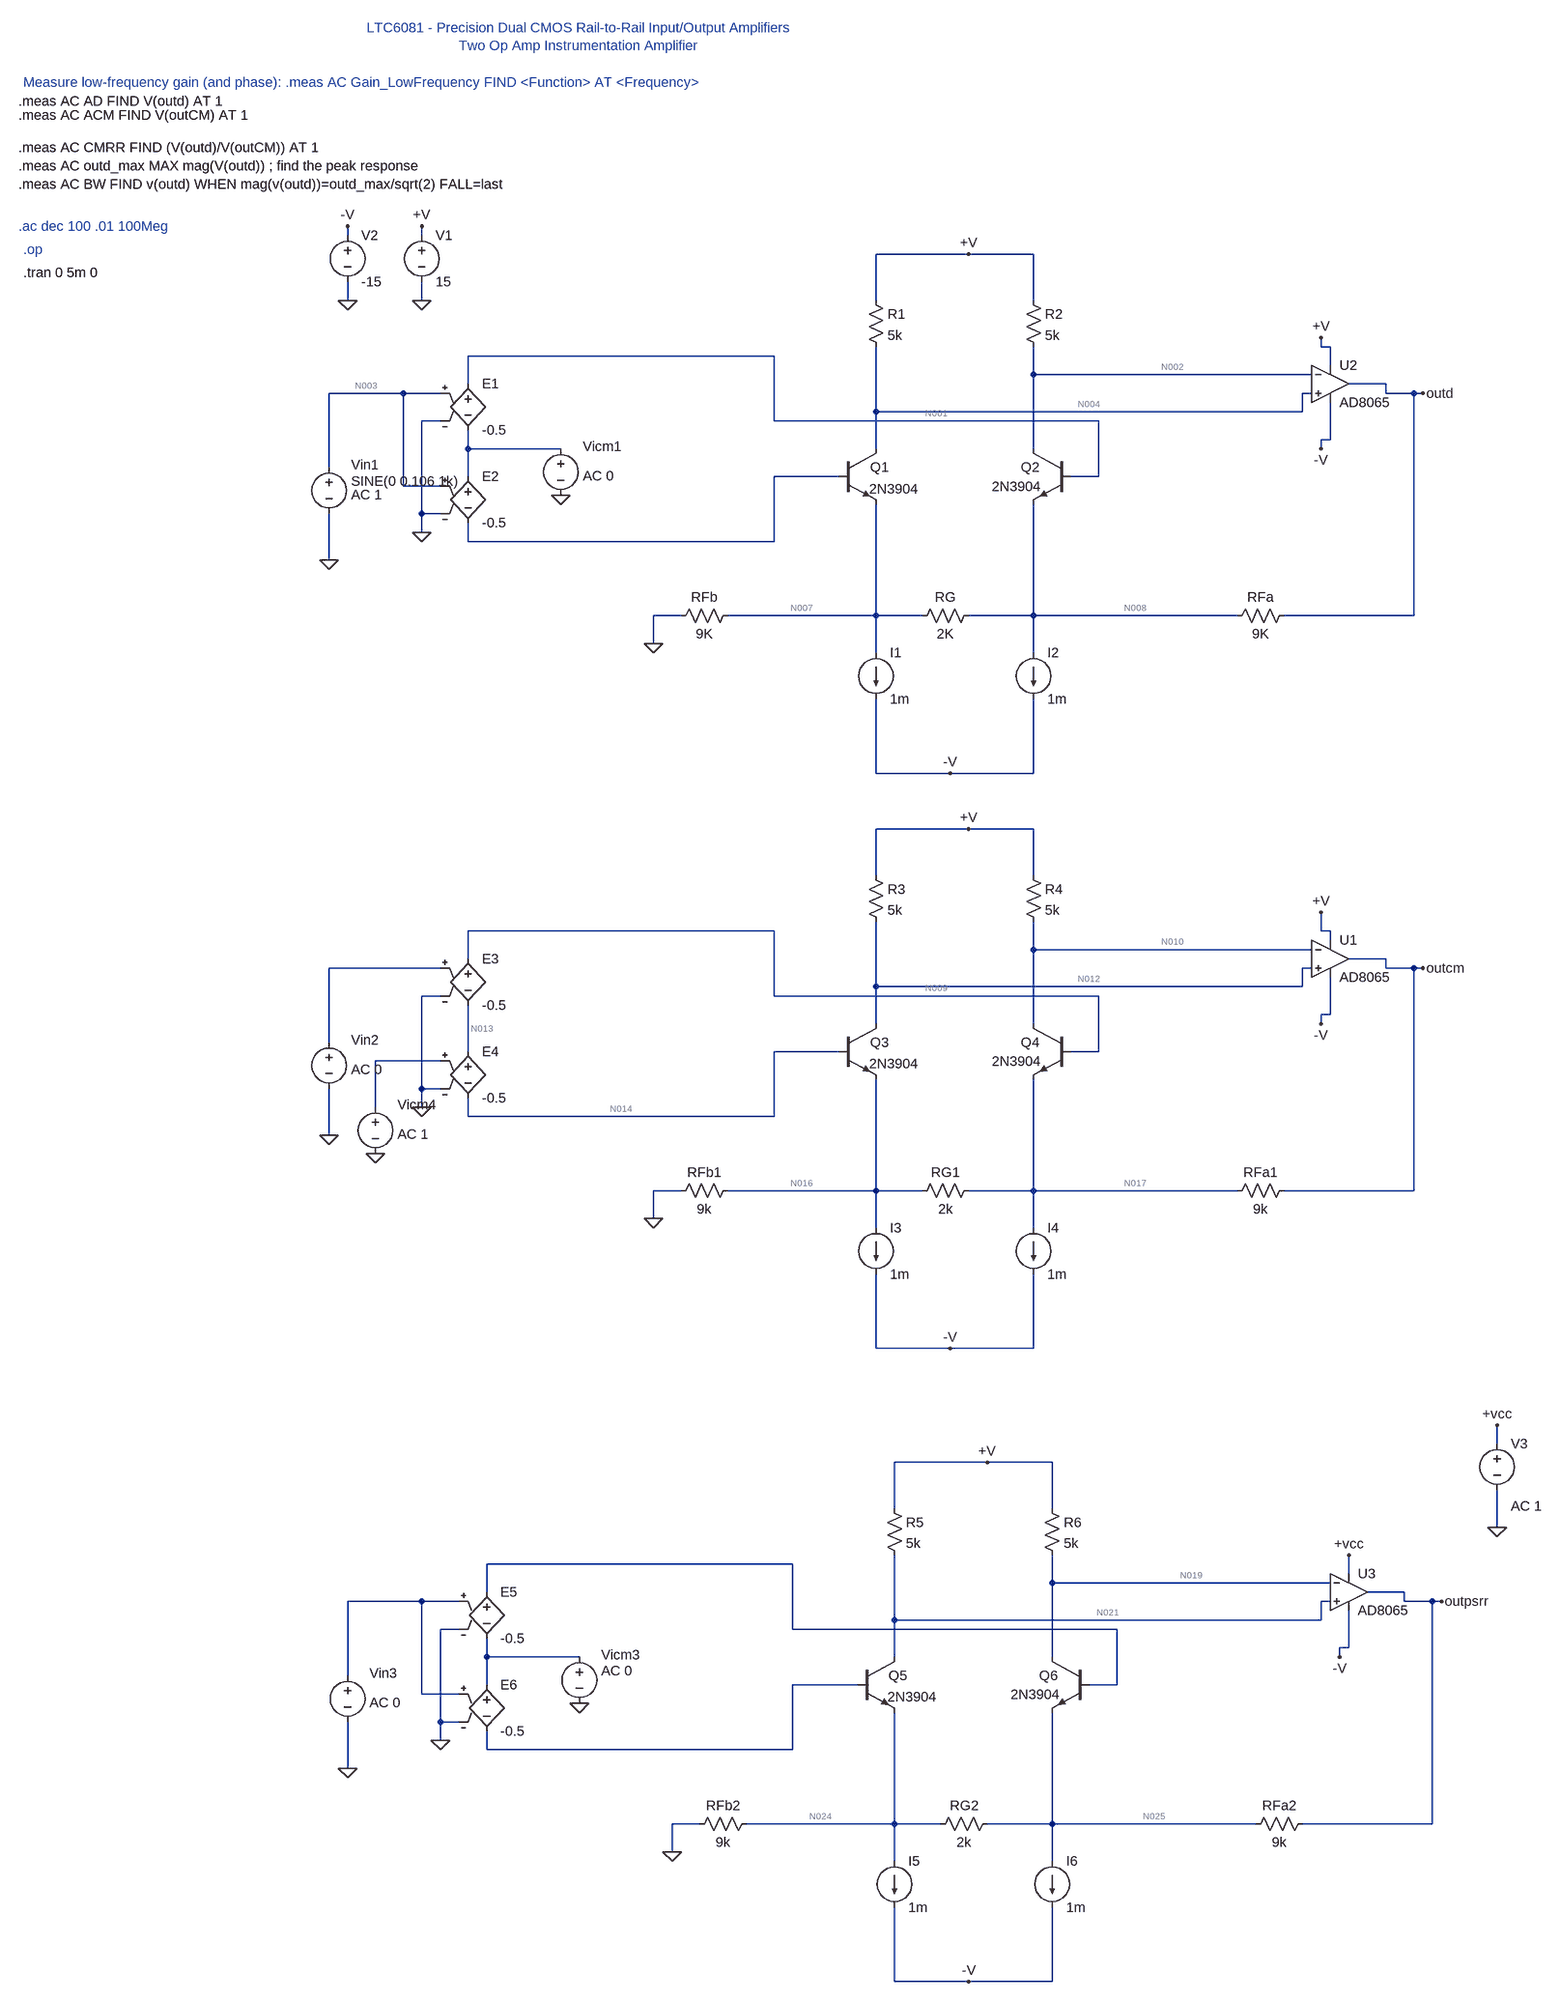
[diagram p0: schematic etaj1.asc]
etaj1.asc, the LTspice schematic file:
Version 4
SHEET 1 3464 3132
WIRE -800 -128 -800 -144
WIRE -672 -128 -672 -144
WIRE 272 -96 112 -96
WIRE 384 -96 272 -96
WIRE -800 -16 -800 -48
WIRE -672 -16 -672 -48
WIRE 112 -16 112 -96
WIRE 384 -16 384 -96
WIRE 880 64 880 48
WIRE 896 64 880 64
WIRE -64 80 -592 80
WIRE 896 96 896 64
WIRE 384 112 384 64
WIRE 864 112 384 112
WIRE -592 128 -592 80
WIRE 992 128 928 128
WIRE -704 144 -832 144
WIRE -640 144 -704 144
WIRE 864 144 848 144
WIRE 992 144 992 128
WIRE 1040 144 992 144
WIRE 1056 144 1040 144
WIRE 112 176 112 64
WIRE 848 176 848 144
WIRE 848 176 112 176
WIRE -640 192 -672 192
WIRE -64 192 -64 80
WIRE 496 192 -64 192
WIRE 896 224 896 160
WIRE 896 224 880 224
WIRE -592 240 -592 208
WIRE -432 240 -592 240
WIRE 112 240 112 176
WIRE 384 240 384 112
WIRE 880 240 880 224
WIRE -832 272 -832 144
WIRE -592 288 -592 240
WIRE 48 288 -64 288
WIRE 496 288 496 192
WIRE 496 288 448 288
WIRE -704 304 -704 144
WIRE -640 304 -704 304
WIRE -672 352 -672 192
WIRE -640 352 -672 352
WIRE -672 384 -672 352
WIRE -592 400 -592 368
WIRE -64 400 -64 288
WIRE -64 400 -592 400
WIRE -832 432 -832 352
WIRE -224 528 -272 528
WIRE 112 528 112 336
WIRE 112 528 -144 528
WIRE 192 528 112 528
WIRE 384 528 384 336
WIRE 384 528 272 528
WIRE 736 528 384 528
WIRE 1040 528 1040 144
WIRE 1040 528 816 528
WIRE -272 576 -272 528
WIRE 112 592 112 528
WIRE 384 592 384 528
WIRE 112 800 112 672
WIRE 240 800 112 800
WIRE 384 800 384 672
WIRE 384 800 240 800
WIRE 272 896 112 896
WIRE 384 896 272 896
WIRE 112 976 112 896
WIRE 384 976 384 896
WIRE -64 1072 -592 1072
WIRE 880 1072 880 1040
WIRE 896 1072 880 1072
WIRE 896 1088 896 1072
WIRE 384 1104 384 1056
WIRE 864 1104 384 1104
WIRE -592 1120 -592 1072
WIRE 992 1120 928 1120
WIRE -640 1136 -832 1136
WIRE 864 1136 848 1136
WIRE 992 1136 992 1120
WIRE 1040 1136 992 1136
WIRE 1056 1136 1040 1136
WIRE 112 1168 112 1056
WIRE 848 1168 848 1136
WIRE 848 1168 112 1168
WIRE -640 1184 -672 1184
WIRE -64 1184 -64 1072
WIRE 496 1184 -64 1184
WIRE 896 1216 896 1152
WIRE 896 1216 880 1216
WIRE 112 1232 112 1168
WIRE 384 1232 384 1104
WIRE 880 1232 880 1216
WIRE -832 1264 -832 1136
WIRE -592 1280 -592 1200
WIRE 48 1280 -64 1280
WIRE 496 1280 496 1184
WIRE 496 1280 448 1280
WIRE -640 1296 -752 1296
WIRE -672 1344 -672 1184
WIRE -640 1344 -672 1344
WIRE -752 1376 -752 1296
WIRE -672 1376 -672 1344
WIRE -592 1392 -592 1360
WIRE -64 1392 -64 1280
WIRE -64 1392 -592 1392
WIRE -832 1424 -832 1344
WIRE -224 1520 -272 1520
WIRE 112 1520 112 1328
WIRE 112 1520 -144 1520
WIRE 192 1520 112 1520
WIRE 384 1520 384 1328
WIRE 384 1520 272 1520
WIRE 736 1520 384 1520
WIRE 1040 1520 1040 1136
WIRE 1040 1520 816 1520
WIRE -272 1568 -272 1520
WIRE 112 1584 112 1520
WIRE 384 1584 384 1520
WIRE 112 1792 112 1664
WIRE 240 1792 112 1792
WIRE 384 1792 384 1664
WIRE 384 1792 240 1792
WIRE 1184 2160 1184 2128
WIRE 304 2192 144 2192
WIRE 416 2192 304 2192
WIRE 144 2272 144 2192
WIRE 416 2272 416 2192
WIRE 1184 2304 1184 2240
WIRE -32 2368 -560 2368
WIRE 928 2384 928 2352
WIRE 416 2400 416 2352
WIRE 896 2400 416 2400
WIRE -560 2416 -560 2368
WIRE 1024 2416 960 2416
WIRE -672 2432 -800 2432
WIRE -608 2432 -672 2432
WIRE 896 2432 880 2432
WIRE 1024 2432 1024 2416
WIRE 1072 2432 1024 2432
WIRE 1088 2432 1072 2432
WIRE 144 2464 144 2352
WIRE 880 2464 880 2432
WIRE 880 2464 144 2464
WIRE -608 2480 -640 2480
WIRE -32 2480 -32 2368
WIRE 528 2480 -32 2480
WIRE 928 2512 928 2448
WIRE 928 2512 912 2512
WIRE -560 2528 -560 2496
WIRE -400 2528 -560 2528
WIRE 144 2528 144 2464
WIRE 416 2528 416 2400
WIRE 912 2528 912 2512
WIRE -800 2560 -800 2432
WIRE -560 2576 -560 2528
WIRE 80 2576 -32 2576
WIRE 528 2576 528 2480
WIRE 528 2576 480 2576
WIRE -672 2592 -672 2432
WIRE -608 2592 -672 2592
WIRE -640 2640 -640 2480
WIRE -608 2640 -640 2640
WIRE -640 2672 -640 2640
WIRE -560 2688 -560 2656
WIRE -32 2688 -32 2576
WIRE -32 2688 -560 2688
WIRE -800 2720 -800 2640
WIRE -192 2816 -240 2816
WIRE 144 2816 144 2624
WIRE 144 2816 -112 2816
WIRE 224 2816 144 2816
WIRE 416 2816 416 2624
WIRE 416 2816 304 2816
WIRE 768 2816 416 2816
WIRE 1072 2816 1072 2432
WIRE 1072 2816 848 2816
WIRE -240 2864 -240 2816
WIRE 144 2880 144 2816
WIRE 416 2880 416 2816
WIRE 144 3088 144 2960
WIRE 272 3088 144 3088
WIRE 416 3088 416 2960
WIRE 416 3088 272 3088
FLAG -672 -16 0
FLAG -672 -144 +V
FLAG -800 -16 0
FLAG -800 -144 -V
FLAG 880 48 +V
FLAG 880 240 -V
FLAG 1056 144 outd
FLAG 272 -96 +V
FLAG -272 576 0
FLAG 240 800 -V
FLAG 880 1040 +V
FLAG 880 1232 -V
FLAG 1056 1136 outcm
FLAG 272 896 +V
FLAG -272 1568 0
FLAG 240 1792 -V
FLAG -832 432 0
FLAG -672 384 0
FLAG -432 320 0
FLAG -832 1424 0
FLAG -672 1376 0
FLAG -752 1456 0
FLAG 912 2528 -V
FLAG 1088 2432 outpsrr
FLAG 304 2192 +V
FLAG -240 2864 0
FLAG 272 3088 -V
FLAG -800 2720 0
FLAG -640 2672 0
FLAG -400 2608 0
FLAG 928 2352 +vcc
FLAG 1184 2304 0
FLAG 1184 2128 +vcc
DATAFLAG 112 112 ""
DATAFLAG 384 96 ""
DATAFLAG 112 480 ""
DATAFLAG 384 448 ""
DATAFLAG 1040 256 ""
DATAFLAG 112 1104 ""
DATAFLAG 384 1088 ""
DATAFLAG 112 1472 ""
DATAFLAG 384 1440 ""
DATAFLAG 1040 1248 ""
DATAFLAG 144 2400 ""
DATAFLAG 416 2384 ""
DATAFLAG 144 2768 ""
DATAFLAG 416 2736 ""
DATAFLAG 1072 2544 ""
SYMBOL voltage -672 -144 R0
WINDOW 123 0 0 Left 2
WINDOW 39 0 0 Left 2
SYMATTR InstName V1
SYMATTR Value 15
SYMBOL voltage -800 -144 R0
WINDOW 123 0 0 Left 2
WINDOW 39 0 0 Left 2
SYMATTR InstName V2
SYMATTR Value -15
SYMBOL npn 48 240 R0
WINDOW 0 54 32 Left 2
WINDOW 3 52 69 Left 2
SYMATTR InstName Q1
SYMATTR Value 2N3904
SYMBOL npn 448 240 M0
WINDOW 0 54 32 Left 2
WINDOW 3 51 65 Left 2
SYMATTR InstName Q2
SYMATTR Value 2N3904
SYMBOL res 96 -32 R0
SYMATTR InstName R1
SYMATTR Value 5k
SYMBOL res 368 -32 R0
SYMATTR InstName R2
SYMATTR Value 5k
SYMBOL res 832 512 R90
WINDOW 0 0 56 VBottom 2
WINDOW 3 32 56 VTop 2
SYMATTR InstName RFa
SYMATTR Value 9K
SYMBOL res 288 512 R90
WINDOW 0 0 56 VBottom 2
WINDOW 3 32 56 VTop 2
SYMATTR InstName RG
SYMATTR Value 2K
SYMBOL res -128 512 R90
WINDOW 0 0 56 VBottom 2
WINDOW 3 32 56 VTop 2
SYMATTR InstName RFb
SYMATTR Value 9K
SYMBOL current 112 592 R0
WINDOW 123 0 0 Left 0
WINDOW 39 0 0 Left 0
SYMATTR InstName I1
SYMATTR Value 1m
SYMBOL current 384 592 R0
WINDOW 123 0 0 Left 0
WINDOW 39 0 0 Left 0
SYMATTR InstName I2
SYMATTR Value 1m
SYMBOL npn 48 1232 R0
WINDOW 0 54 32 Left 2
WINDOW 3 52 69 Left 2
SYMATTR InstName Q3
SYMATTR Value 2N3904
SYMBOL npn 448 1232 M0
WINDOW 0 54 32 Left 2
WINDOW 3 51 65 Left 2
SYMATTR InstName Q4
SYMATTR Value 2N3904
SYMBOL res 96 960 R0
SYMATTR InstName R3
SYMATTR Value 5k
SYMBOL res 368 960 R0
SYMATTR InstName R4
SYMATTR Value 5k
SYMBOL res 832 1504 R90
WINDOW 0 0 56 VBottom 2
WINDOW 3 32 56 VTop 2
SYMATTR InstName RFa1
SYMATTR Value 9k
SYMBOL res 288 1504 R90
WINDOW 0 0 56 VBottom 2
WINDOW 3 32 56 VTop 2
SYMATTR InstName RG1
SYMATTR Value 2k
SYMBOL res -128 1504 R90
WINDOW 0 0 56 VBottom 2
WINDOW 3 32 56 VTop 2
SYMATTR InstName RFb1
SYMATTR Value 9k
SYMBOL current 112 1584 R0
WINDOW 123 0 0 Left 0
WINDOW 39 0 0 Left 0
SYMATTR InstName I3
SYMATTR Value 1m
SYMBOL current 384 1584 R0
WINDOW 123 0 0 Left 0
WINDOW 39 0 0 Left 0
SYMATTR InstName I4
SYMATTR Value 1m
SYMBOL voltage -832 256 R0
WINDOW 123 38 63 Left 2
WINDOW 39 0 0 Left 2
WINDOW 0 38 12 Left 2
WINDOW 3 38 40 Left 2
SYMATTR Value2 AC 1
SYMATTR InstName Vin1
SYMATTR Value SINE(0 0.106 1k)
SYMBOL e -592 112 R0
SYMATTR InstName E1
SYMATTR Value -0.5
SYMBOL e -592 272 R0
SYMATTR InstName E2
SYMATTR Value -0.5
SYMBOL voltage -432 224 R0
WINDOW 123 38 63 Left 2
WINDOW 39 0 0 Left 2
WINDOW 0 38 12 Left 2
WINDOW 3 -188 38 Left 2
SYMATTR Value2 AC 0
SYMATTR InstName Vicm1
SYMATTR Value ""
SYMBOL voltage -832 1248 R0
WINDOW 123 38 63 Left 2
WINDOW 39 0 0 Left 2
WINDOW 0 38 12 Left 2
WINDOW 3 -188 38 Left 2
SYMATTR Value2 AC 0
SYMATTR InstName Vin2
SYMATTR Value ""
SYMBOL e -592 1104 R0
SYMATTR InstName E3
SYMATTR Value -0.5
SYMBOL e -592 1264 R0
SYMATTR InstName E4
SYMATTR Value -0.5
SYMBOL OpAmps\\AD8065 896 64 R0
SYMATTR InstName U2
SYMBOL OpAmps\\AD8065 896 1056 R0
SYMATTR InstName U1
SYMBOL voltage -752 1360 R0
WINDOW 123 38 63 Left 2
WINDOW 39 0 0 Left 2
WINDOW 0 38 12 Left 2
WINDOW 3 -188 38 Left 2
SYMATTR Value2 AC 1
SYMATTR InstName Vicm4
SYMATTR Value ""
SYMBOL npn 80 2528 R0
WINDOW 0 54 32 Left 2
WINDOW 3 52 69 Left 2
SYMATTR InstName Q5
SYMATTR Value 2N3904
SYMBOL npn 480 2528 M0
WINDOW 0 54 32 Left 2
WINDOW 3 51 65 Left 2
SYMATTR InstName Q6
SYMATTR Value 2N3904
SYMBOL res 128 2256 R0
SYMATTR InstName R5
SYMATTR Value 5k
SYMBOL res 400 2256 R0
SYMATTR InstName R6
SYMATTR Value 5k
SYMBOL res 864 2800 R90
WINDOW 0 0 56 VBottom 2
WINDOW 3 32 56 VTop 2
SYMATTR InstName RFa2
SYMATTR Value 9k
SYMBOL res 320 2800 R90
WINDOW 0 0 56 VBottom 2
WINDOW 3 32 56 VTop 2
SYMATTR InstName RG2
SYMATTR Value 2k
SYMBOL res -96 2800 R90
WINDOW 0 0 56 VBottom 2
WINDOW 3 32 56 VTop 2
SYMATTR InstName RFb2
SYMATTR Value 9k
SYMBOL current 144 2880 R0
WINDOW 123 0 0 Left 0
WINDOW 39 0 0 Left 0
SYMATTR InstName I5
SYMATTR Value 1m
SYMBOL current 416 2880 R0
WINDOW 123 0 0 Left 0
WINDOW 39 0 0 Left 0
SYMATTR InstName I6
SYMATTR Value 1m
SYMBOL voltage -800 2544 R0
WINDOW 123 38 63 Left 2
WINDOW 39 0 0 Left 2
WINDOW 0 38 12 Left 2
WINDOW 3 -188 38 Left 2
SYMATTR Value2 AC 0
SYMATTR InstName Vin3
SYMATTR Value ""
SYMBOL e -560 2400 R0
SYMATTR InstName E5
SYMATTR Value -0.5
SYMBOL e -560 2560 R0
SYMATTR InstName E6
SYMATTR Value -0.5
SYMBOL voltage -400 2512 R0
WINDOW 123 38 40 Left 2
WINDOW 39 0 0 Left 2
WINDOW 0 38 12 Left 2
WINDOW 3 -188 38 Left 2
SYMATTR Value2 AC 0
SYMATTR InstName Vicm3
SYMATTR Value ""
SYMBOL OpAmps\\AD8065 928 2352 R0
SYMATTR InstName U3
SYMBOL voltage 1184 2144 R0
WINDOW 123 24 124 Left 2
WINDOW 39 0 0 Left 0
SYMATTR Value2 AC 1
SYMATTR InstName V3
SYMATTR Value ""
TEXT -1368 -144 Left 2 ;.ac dec 100 .01 100Meg
TEXT -1368 -360 Left 2 !.meas AC AD FIND V(outd) AT 1
TEXT -1360 -392 Left 2 ;Measure low-frequency gain (and phase): .meas AC Gain_LowFrequency FIND <Function> AT <Frequency>
TEXT -1368 -336 Left 2 !.meas AC ACM FIND V(outCM) AT 1
TEXT -1368 -280 Left 2 !.meas AC CMRR FIND (V(outd)/V(outCM)) AT 1
TEXT -400 -440 Bottom 2 ;LTC6081 - Precision Dual CMOS Rail-to-Rail Input/Output Amplifiers\nTwo Op Amp Instrumentation Amplifier
TEXT -1368 -248 Left 2 !.meas AC outd_max MAX mag(V(outd)) ; find the peak response\n.meas AC BW FIND v(outd) WHEN mag(v(outd))=outd_max/sqrt(2) FALL=last
TEXT -1360 -104 Left 2 ;.op
TEXT -1360 -64 Left 2 !.tran 0 5m 0

The netlist it stands for:
* etaj1.asc
V1 +V 0 15
V2 -V 0 -15
Q1 N004 N006 N007 0 2N3904
Q2 N002 N001 N008 0 2N3904
R1 +V N004 5k
R2 +V N002 5k
RFa outd N008 9K
RG N008 N007 2K
RFb N007 0 9K
I1 N007 -V 1m
I2 N008 -V 1m
Q3 N012 N014 N016 0 2N3904
Q4 N010 N009 N017 0 2N3904
R3 +V N012 5k
R4 +V N010 5k
RFa1 outcm N017 9k
RG1 N017 N016 2k
RFb1 N016 0 9k
I3 N016 -V 1m
I4 N017 -V 1m
Vin1 N003 0 SINE(0 0.106 1k) AC 1
E1 N001 N005 N003 0 -0.5
E2 N005 N006 N003 0 -0.5
Vicm1 N005 0 AC 0
Vin2 N011 0 AC 0
E3 N009 N013 N011 0 -0.5
E4 N013 N014 N015 0 -0.5
XU2 N004 N002 +V -V outd AD8065  ; pins In+ In- V+ V- OUT
XU1 N012 N010 +V -V outcm AD8065  ; pins In+ In- V+ V- OUT
Vicm4 N015 0 AC 1
Q5 N021 N023 N024 0 2N3904
Q6 N019 N018 N025 0 2N3904
R5 +V N021 5k
R6 +V N019 5k
RFa2 outpsrr N025 9k
RG2 N025 N024 2k
RFb2 N024 0 9k
I5 N024 -V 1m
I6 N025 -V 1m
Vin3 N020 0 AC 0
E5 N018 N022 N020 0 -0.5
E6 N022 N023 N020 0 -0.5
Vicm3 N022 0 AC 0
XU3 N021 N019 +vcc -V outpsrr AD8065  ; pins In+ In- V+ V- OUT
V3 +vcc 0 AC 1
.model NPN NPN
.model PNP PNP
.lib standard.bjt
* .ac dec 100 .01 100Meg
.meas AC AD FIND V(outd) AT 1
* Measure low-frequency gain (and phase): .meas AC Gain_LowFrequency FIND <Function> AT <Frequency>
.meas AC ACM FIND V(outCM) AT 1
.meas AC CMRR FIND (V(outd)/V(outCM)) AT 1
* LTC6081 - Precision Dual CMOS Rail-to-Rail Input/Output Amplifiers
* Two Op Amp Instrumentation Amplifier
.meas AC outd_max MAX mag(V(outd)) ; find the peak response
.meas AC BW FIND v(outd) WHEN mag(v(outd))=outd_max/sqrt(2) FALL=last
* .op
.tran 0 5m 0
.backanno
.end

* Results of the author's LTspice run, read from the files saved beside the schematic
* Operating Point, zero values left out:
*   V(+v) = 15 V
*   V(-v) = -15 V
*   V(n004) = 10.38 V
*   V(n007) = -650.7 mV
*   V(n002) = 10.38 V
*   V(n008) = -650.8 mV
*   V(outd) = -743.9 µV
*   V(n012) = 15 V
*   V(n014) = -16.91 V
*   V(n016) = -15.78 V
*   V(n010) = 15 V
*   V(n009) = -16.91 V
*   V(n017) = -17.28 V
*   V(outcm) = -15.06 V
*   V(n013) = -16.91 V
*   V(n021) = 10.3 V
*   V(n024) = -651.2 mV
*   V(n019) = 2.131 V
*   V(n025) = -679.6 mV
*   V(outpsrr) = -15.06 V
*   Ic(Q1) = 924.9 µA
*   Ib(Q1) = 2.799 µA
*   Ie(Q1) = -927.7 µA
*   Ic(Q2) = 925 µA
*   Ib(Q2) = 2.799 µA
*   Ie(Q2) = -927.8 µA
*   Ic(Q3) = 31.92 pA
*   Ib(Q3) = -33.04 pA
*   Ie(Q3) = 1.119 pA
*   Ic(Q4) = 25.59 nA
*   Ib(Q4) = 33.04 pA
*   Ie(Q4) = -25.62 nA
*   Ic(Q5) = 939 µA
*   Ib(Q5) = 2.844 µA
*   Ie(Q5) = -941.9 µA
*   Ic(Q6) = 2.575 mA
*   Ib(Q6) = 8.456 µA
*   Ie(Q6) = -2.583 mA
*   I(I1) = 1 mA
*   I(I2) = 1 mA
*   I(I3) = 1 mA
*   I(I4) = 1 mA
*   I(I5) = 1 mA
*   I(I6) = 1 mA
*   I(R1) = 924.9 µA
*   I(R2) = 925 µA
*   I(Rfa) = 72.22 µA
*   I(Rg) = -1.171 nA
*   I(Rfb) = -72.31 µA
*   I(R3) = 1.503 nA
*   I(R4) = 27.11 nA
*   I(Rfa1) = 247.2 µA
*   I(Rg1) = -752.8 µA
*   I(Rfb1) = -1.753 mA
*   I(R5) = 939.9 µA
*   I(R6) = 2.574 mA
*   I(Rfa2) = -1.597 mA
*   I(Rg2) = -14.23 µA
*   I(Rfb2) = -72.35 µA
*   I(E1) = -2.799 µA
*   I(E2) = 2.799 µA
*   I(E3) = -33.04 pA
*   I(E4) = -33.04 pA
*   I(E5) = -8.456 µA
*   I(E6) = 2.844 µA
*   I(V1) = -18.49 mA
*   I(V2) = 26.8 mA
*   I(Vicm1) = -5.598 µA
*   I(Vicm3) = -11.3 µA
*   I(V3) = -6.401 mA
*   Ix(u2:100) = 1.036 nA
*   Ix(u2:101) = 1.037 nA
*   Ix(u2:102) = 6.474 mA
*   Ix(u2:103) = -6.402 mA
*   Ix(u2:104) = -72.22 µA
*   Ix(u1:100) = 1.469 nA
*   Ix(u1:101) = 1.526 nA
*   Ix(u1:102) = 6.649 mA
*   Ix(u1:103) = -6.402 mA
*   Ix(u1:104) = -247.2 µA
*   Ix(u3:100) = 818.7 nA
*   Ix(u3:101) = -816 nA
*   Ix(u3:102) = 6.401 mA
*   Ix(u3:103) = -7.998 mA
*   Ix(u3:104) = 1.597 mA
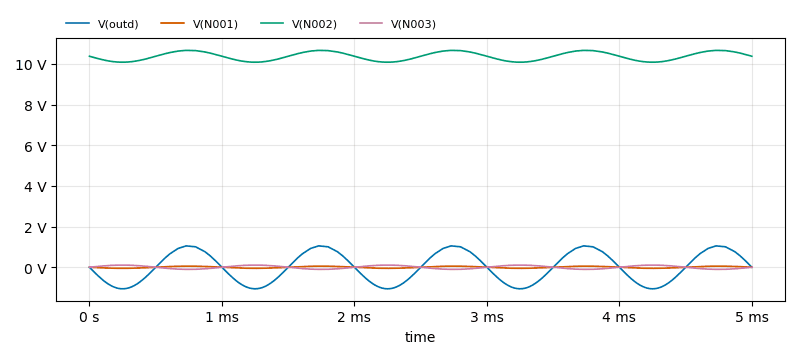
[diagram p1: Transient Analysis of etaj1.asc, plotted from the saved traces]
* Transient Analysis, 1 run:
*   V(outd): min -1.06 V, max 1.05 V, average -4.617 mV, rms 746.6 mV, last -703.9 µV
*   V(N001): min -52.99 mV, max 52.57 mV, average -193.8 µV, rms 37.34 mV, last 0 V
*   V(N002): min 10.08 V, max 10.67 V, average 10.37 V, rms 10.38 V, last 10.38 V
*   V(N003): min -105.2 mV, max 106 mV, average 387.3 µV, rms 74.7 mV, last 0 V